# Altium schematic sheet Charger.SchDoc
size A3; SheetNumber: 2; SheetTotal: 2
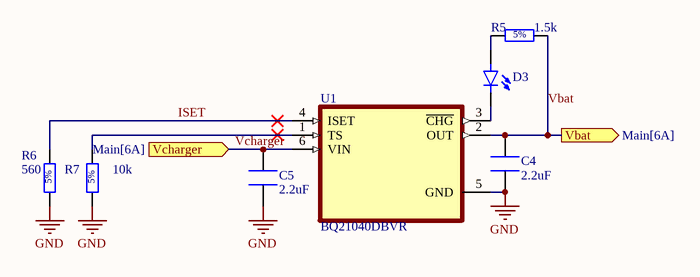
[diagram p0: Charger.SchDoc]

## Parts
C4  2.2uF  [CAPACITOR_0805_2012M-70N]
C5  2.2uF  [CAPACITOR_0805_2012M-70N]
D3  LTST-C190 Series  [LED_0603_1608M_0.80mm]  (value not drawn)
R5  1.5k  [Resistor_0805_2012M-50N]
R6  560  [Resistor_0805_2012M-50N]
R7  10k  [Resistor_0805_2012M-50N]
U1  BQ21040DBVR  [SOT95P280X145-6N]

## Ports
Vbat (out, see Main[6A]), Vcharger (in, see Main[6A])

## Nets
GND: C4.1 C5.1 R6.1 R7.1 U1.5(GND)
ISET: R6.2 U1.4(ISET)
Vbat: C4.2 R5.2 U1.2(OUT) ; port Vbat
Vcharger: C5.2 U1.6(VIN) ; port Vcharger
NetD3_A: D3.A R5.1
NetD3_C: D3.C U1.3(~{CHG})
NetR7_2: R7.2 U1.1(TS)

## Library data of the parts
C4 C5 = C0805C225K8PACTU: Passive - Capacitor, X5R, 2.2uF Max, 10V, 0805 (2012 Metric), ±10%, -55°C ~ 85°C. 2uF @ 5V, 1.1uF @ 10V; APSS Standard Part: APSS Standard; Capacitance at Rated Voltage: 50%; Tolerance: ±10%; Temperature Coefficient: X5R; Rated Voltage: 10V; Temp Range: -55°C ~ 85°C; Package: 0805; Supplier 1: Digikey; Supplier 1 Part No.: 399-C0805C225K8PACTUCT-ND; MF Part No.: C0805C225K8PACTU; Value: 2.2uF
D3 = LTST-C190 Series: Diode - LED, 0603; APSS Standard Part: APSS Standard; Temp Range: -30°C ~ 85°C; Rated Voltage: 5V Reverse; Package: 0603; Supplier 1: Digikey; MF Part No.: *; Colour: *
R5-R7 = RMCF0805JT Series: Passive - Resistor Series, 0805, 5%, 100m - 22M, E24, 0.063W, 1/16W, ±200ppm/°C, -55°C ~ 155°C, 0805 (2012 Metric); APSS Standard Part: APSS Standard; Power: 1/8W; Value Range: 100m ~ 22M; Rated Voltage: 150V; Tolerance: 5%; E Series: E24; Temp Range: -55°C ~ 155°C; Supplier 1: Digikey; Package: 0805; Temperature Coefficient: ±200ppm/°C; MF Part No.: *
  R5: Value: 1.5k
  R6: Value: 560
  R7: Value: 10k
U1 = BQ21040DBVR: 1-cell, 0.8-A Li-ion and Li-polymer battery charger; MF: Texas Instruments; Package: SOT23-6; MF Part No.: BQ21040DBVR; Value: *; Supplier 1 Part No.: 296-47315-1-ND; Supplier 1: Digikey